# EAGLE schematic fmcw (EAGLE 6.6.0)
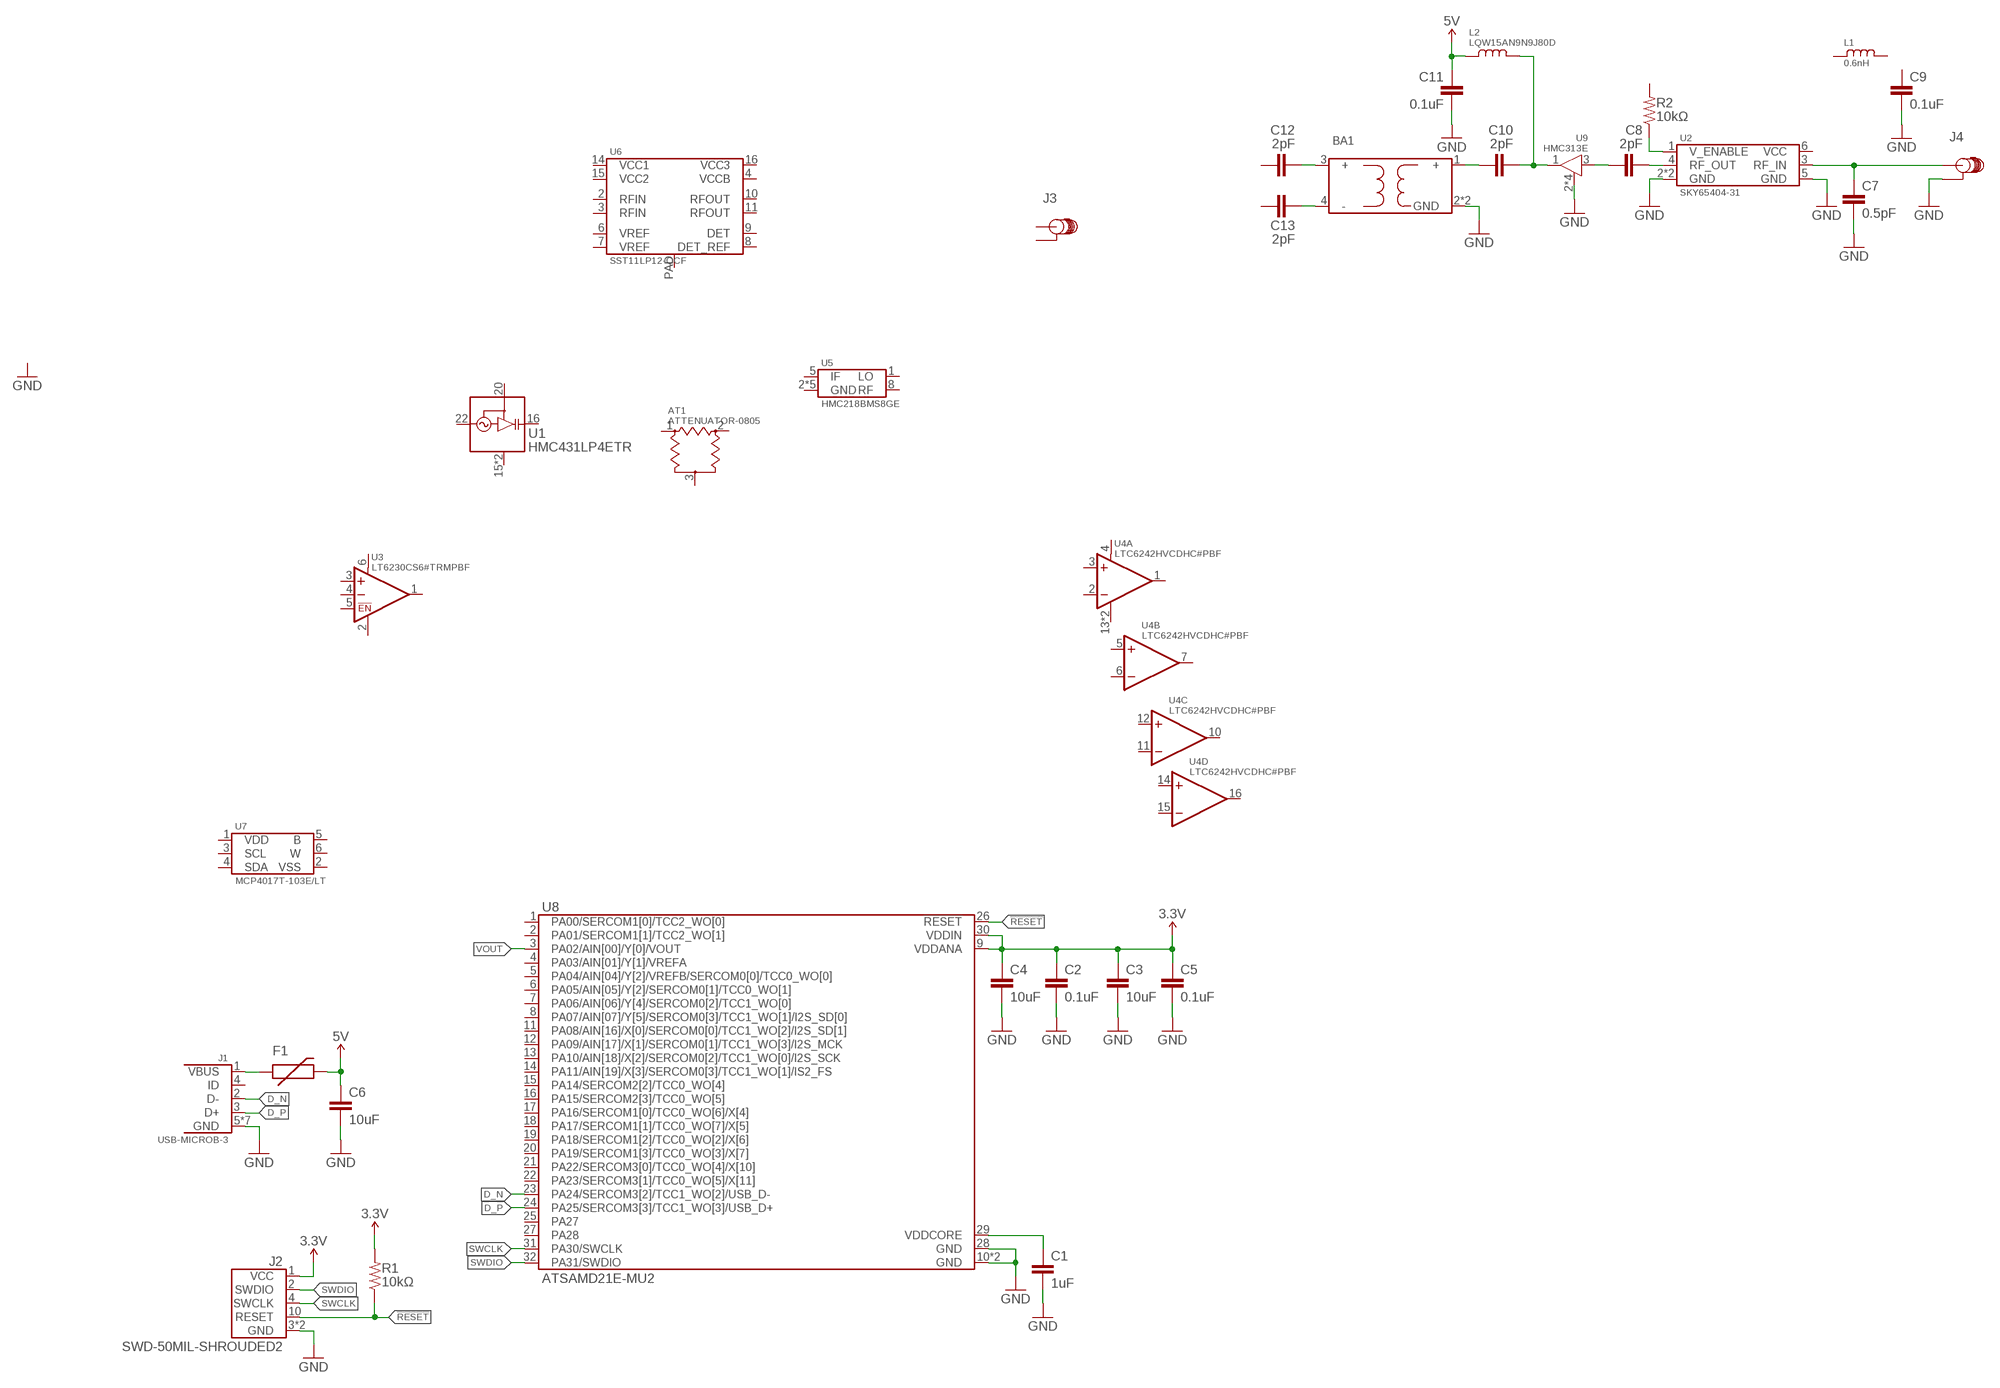
[diagram p0: schematic, sheet 1]

## Parts
AT1  ATTENUATOR-0805  [0805-ATTENUATOR]
BA1  BALUN-0805  [0805-BALUN]
C1  1uF  CAP-0603  [0603-CAP]
C2  0.1uF  CAP-0603  [0603-CAP]
C3  10uF  CAP-0603  [0603-CAP]
C4  10uF  CAP-0603  [0603-CAP]
C5  0.1uF  CAP-0603  [0603-CAP]
C6  10uF  CAP-0603  [0603-CAP]
C7  0.5pF  CAP-0603  [0603-CAP]
C8  2pF  CAP-0603  [0603-CAP]
C9  0.1uF  CAP-0603  [0603-CAP]
C10  2pF  CAP-0603  [0603-CAP]
C11  0.1uF  CAP-0603  [0603-CAP]
C12  2pF  CAP-0603  [0603-CAP]
C13  2pF  CAP-0603  [0603-CAP]
F1  PTC-1206  [1206-PTC]
J1  USB-MICROB-3  [10118192-0001LF]
J2  SWD-50MIL-SHROUDED2  [M05X2-50MIL-SHROUD]
J3  SMA-EDGE  [SMA-EDGE]
J4  SMA-EDGE  [SMA-EDGE]
L1  0.6nH  INDUCTOR-0603  [0603-FERRITE]
L2  LQW15AN9N9J80D  INDUCTOR-0402  [0402-INDUCTOR]
R1  10kΩ  RESISTOR-0603  [0603-CAP]
R2  10kΩ  RESISTOR-0603  [0603-CAP]
U1  HMC431LP4ETR  [VQFN-24-4MM_2]
U2  SKY65404-31  [XFDFN-6-1.5MM]
U3  LT6230CS6#TRMPBF  [TSOT-23-6]
U4  LTC6242HVCDHC#PBF  [WFDFN-16]
U5  HMC218BMS8GE  [MSOP-8-EP]
U6  SST11LP12-QCF  [WFQFN-16-3MM]
U7  MCP4017T-103E/LT  [SC-70-6]
U8  ATSAMD21E-MU2  [QFN-32-5MM]
U9  HMC313E  [SOT-23-6]

## Nets
3.3V: C2.1 C3.1 C4.1 C5.1 J2.1(VCC) R1.2 U8.9(VDDANA) U8.30(VDDIN)
5V: C6.1 C11.1 F1.P$2 L2.1
!RESET: J2.10(RESET) R1.1 U8.26(!RESET)
D_N: J1.2(D-) U8.23(PA24/SERCOM3[2]/TCC1_WO[2]/USB_D-)
D_P: J1.3(D+) U8.24(PA25/SERCOM3[3]/TCC1_WO[3]/USB_D+)
GND: BA1.2(GND) BA1.5(GND) C1.2 C2.2 C3.2 C4.2 C5.2 C6.2 C7.2 C9.2 C11.2 J1.5(GND) J1.P$6(GND) J1.P$7(GND) J1.P$8(GND) J1.P$9(GND) J1.P$10(GND) J1.P$11(GND) J2.3(GND) J2.5(GND) J4.P$1(GND) J4.P$2(GND) J4.P$3(GND) J4.P$4(GND) U2.2(GND) U2.5(GND) U2.PAD(GND) U8.10(GND) U8.28(GND) U8.PAD(GND) U9.2(GND) U9.4(GND) U9.5(GND) U9.6(GND)
N$1: F1.P$1 J1.1(VBUS)
N$2: C1.1 U8.29(VDDCORE)
N$3: C7.1 J4.SIGNAL U2.3(RF_IN)
N$4: R2.1 U2.1(V_ENABLE)
N$5: C8.2 U2.4(RF_OUT)
N$6: C8.1 U9.3(RFIN)
N$7: C10.2 L2.2 U9.1(RFOUT)
N$8: BA1.1(+) C10.1
N$9: BA1.3(+) C12.2
N$10: BA1.4(-) C13.2
SWCLK: J2.4(SWCLK) U8.31(PA30/SWCLK)
SWDIO: J2.2(SWDIO) U8.32(PA31/SWDIO)
VOUT: U8.3(PA02/AIN[00]/Y[0]/VOUT)
Unconnected: AT1.1 AT1.2 AT1.3 C9.1 C12.1 C13.1 J1.4(ID) J3.P$1(GND) J3.P$2(GND) J3.P$3(GND) J3.P$4(GND) J3.SIGNAL L1.P$1 L1.P$2 R2.2 U1.15(GND) U1.16(RFOUT) U1.20(VCC) U1.22(VTUNE) U1.PAD(GND) U2.6(VCC) U3.1(OUT) U3.3(+IN) U3.4(-IN) U3.5(!EN) U4.1(A:OUT) U4.2(A:-IN) U4.3(A:+IN) U4.5(B:+IN) U4.6(B:-IN) U4.7(B:OUT) U4.10(C:OUT) U4.11(C:-IN) U4.12(C:+IN) U4.14(D:+IN) U4.15(D:-IN) U4.16(D:OUT) U5.1(LO) U5.2(GND) U5.3(GND) U5.5(IF) U5.6(GND) U5.7(GND) U5.8(RF) U5.PAD(GND) U6.2(RFIN) U6.3(RFIN) U6.4(VCCB) U6.6(VREF) U6.7(VREF) U6.8(DET_REF) U6.9(DET) U6.10(RFOUT) U6.11(RFOUT) U6.14(VCC1) U6.15(VCC2) U6.16(VCC3) U6.PAD(GND) U7.1(VDD) U7.2(VSS) U7.3(SCL) U7.4(SDA) U7.5(B) U7.6(W) U8.1(PA00/SERCOM1[0]/TCC2_WO[0]) U8.2(PA01/SERCOM1[1]/TCC2_WO[1]) U8.4(PA03/AIN[01]/Y[1]/VREFA) U8.5(PA04/AIN[04]/Y[2]/VREFB/SERCOM0[0]/TCC0_WO[0]) U8.6(PA05/AIN[05]/Y[2]/SERCOM0[1]/TCC0_WO[1]) U8.7(PA06/AIN[06]/Y[4]/SERCOM0[2]/TCC1_WO[0]) U8.8(PA07/AIN[07]/Y[5]/SERCOM0[3]/TCC1_WO[1]/I2S_SD[0]) U8.11(PA08/AIN[16]/X[0]/SERCOM0[0]/TCC1_WO[2]/I2S_SD[1]) U8.12(PA09/AIN[17]/X[1]/SERCOM0[1]/TCC1_WO[3]/I2S_MCK) U8.13(PA10/AIN[18]/X[2]/SERCOM0[2]/TCC1_WO[0]/I2S_SCK) U8.14(PA11/AIN[19]/X[3]/SERCOM0[3]/TCC1_WO[1]/IS2_FS) U8.15(PA14/SERCOM2[2]/TCC0_WO[4]) U8.16(PA15/SERCOM2[3]/TCC0_WO[5]) U8.17(PA16/SERCOM1[0]/TCC0_WO[6]/X[4]) U8.18(PA17/SERCOM1[1]/TCC0_WO[7]/X[5]) U8.19(PA18/SERCOM1[2]/TCC0_WO[2]/X[6]) U8.20(PA19/SERCOM1[3]/TCC0_WO[3]/X[7]) U8.21(PA22/SERCOM3[0]/TCC0_WO[4]/X[10]) U8.22(PA23/SERCOM3[1]/TCC0_WO[5]/X[11]) U8.25(PA27) U8.27(PA28)

## Power pins joined to a net without a drawn wire
V+: U3.6(V+) U4.4(A:V+)
V-: U3.2(V-) U4.13(A:V-) U4.PAD(A:V-)

## Library data of the parts
AT1 = Passives:ATTENUATOR
BA1 = Passives:BALUN
C1-C13 = Passives:CAP
F1 = Passives:PTC
J1 = Connectors:USB-MICROB
J2 = Connectors:SWD
J3 J4 = Connectors:SMA
L1 L2 = Passives:INDUCTOR
R1 R2 = Passives:RESISTOR
U1 = AnalogDevices:HMC431
U2 = Skyworks:SKY65404
U3 = Linear Technology:LT6230
U4 = Linear Technology:LTC6242
U5 = AnalogDevices:HMC218BMS8GE
U6 = Microchip:SST11LP12
U7 = Microchip:MCP4017
U8 = Atmel:ATSAMD21E
U9 = AnalogDevices:HMC313